# Altium schematic sheet TesteKK.SchDoc
size A4
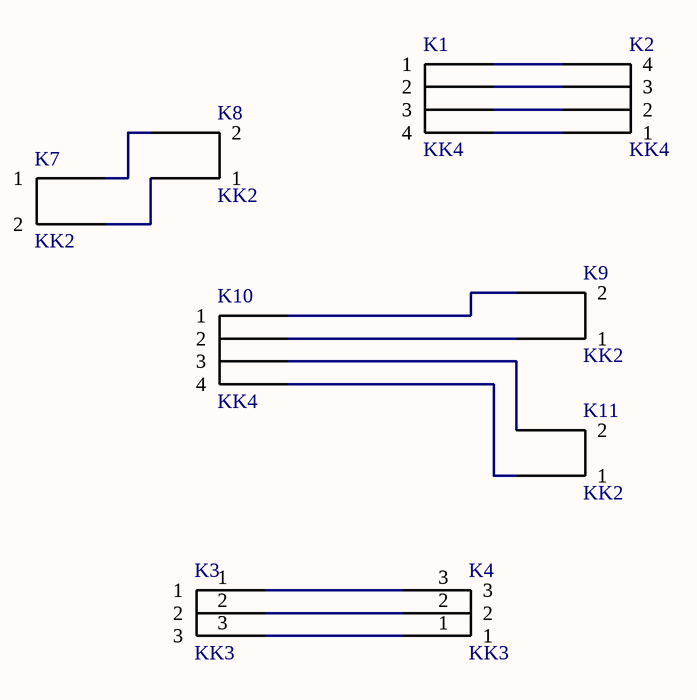
[diagram p0: TesteKK.SchDoc]

## Parts
K1  KK4  [4-vias]
K2  KK4  [4-vias]
K3  KK3  [3-vias]
K4  KK3  [3-vias]
K7  KK2  [2-vias]
K8  KK2  [2-vias]
K9  KK2  [2-vias]
K10  KK4  [4-vias]
K11  KK2  [2-vias]

## Nets
NetK1_1: K1.1 K2.4
NetK1_2: K1.2 K2.3
NetK1_3: K1.3 K2.2
NetK1_4: K1.4 K2.1
NetK3_1: K3.1 K4.3
NetK3_2: K3.2 K4.2
NetK3_3: K3.3 K4.1
NetK7_1: K7.1 K8.2
NetK7_2: K7.2 K8.1
NetK9_1: K9.1 K10.2
NetK9_2: K9.2 K10.1
NetK10_3: K10.3 K11.2
NetK10_4: K10.4 K11.1

## Library data of the parts
K1 K2 K10 = KK4Vias: ComponentLink1Description: Fabricante; ComponentLink1URL: https://www.molex.com/molex/products/family?key=kk_254_rpc_connector_system&channel=products&chanName=family&pageTitle=Introduction&parentKey=kk_interconnect_solutions
K3 K4 = KK3Vias
K7-K9 K11 = KK2Vias